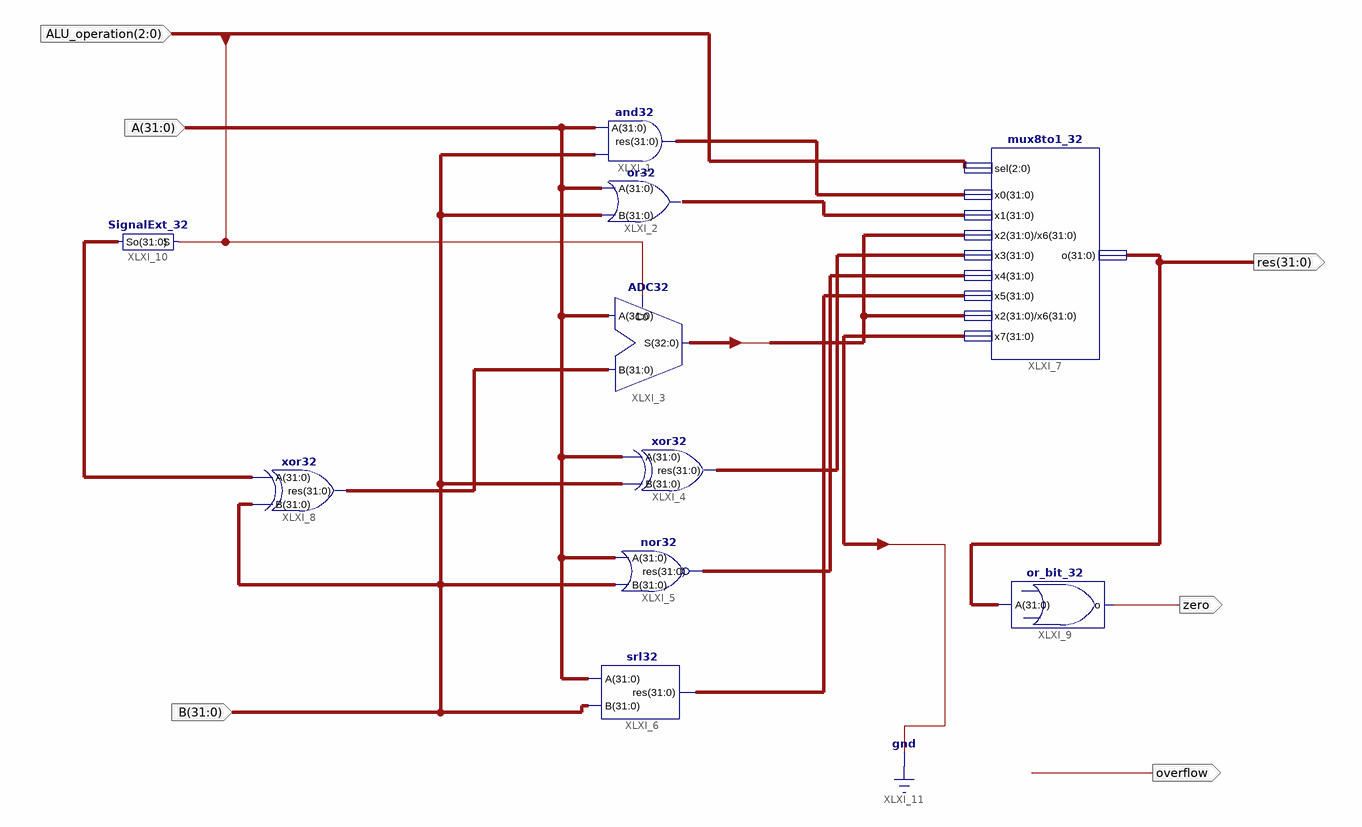
[diagram p0: schematic sheet 1]
// Xilinx ISE schematic alu.sch (spartan6) as structural Verilog: 10 symbols, 6 ports
module alu (
  input  [31:0] B,
  input  [2:0] ALU_operation,
  input  [31:0] A,
  output [31:0] res,
  output zero,
  output overflow
);

  wire [31:0] XLXN_12, XLXN_15, XLXN_24, XLXN_25, XLXN_26, XLXN_27, XLXN_28;
  wire [32:0] S;

  and32 XLXI_1 (.res(XLXN_24), .A(A), .B(B));
  or32 XLXI_2 (.A(A), .B(B));  // open: res
  ADC32 XLXI_3 (.B(XLXN_15), .A(A), .C0(ALU_operation[2]), .S(S));
  xor32 XLXI_4 (.A(A), .B(B), .res(XLXN_26));
  nor32 XLXI_5 (.res(XLXN_27), .A(A), .B(B));
  srl32 XLXI_6 (.A(A), .B(B), .res(XLXN_28));
  mux8to1_32 XLXI_7 (
    .x1(XLXN_25), .sel(ALU_operation), .o(res), .x0(XLXN_24), .x2(S[31:0]), .x3(XLXN_26), .x4(XLXN_27),
    .x5(XLXN_28), .x6(S[31:0]), .x7({{31{1'b0}}, S[32]}));
  xor32 XLXI_8 (.A(XLXN_12), .B(B), .res(XLXN_15));
  or_bit_32 XLXI_9 (.o(zero), .A(res));
  SignalExt_32 XLXI_10 (.So(XLXN_12), .S(ALU_operation[2]));
endmodule
